# Altium schematic sheet leds.SchDoc
size A4; SheetNumber: 11; SheetTotal: 11
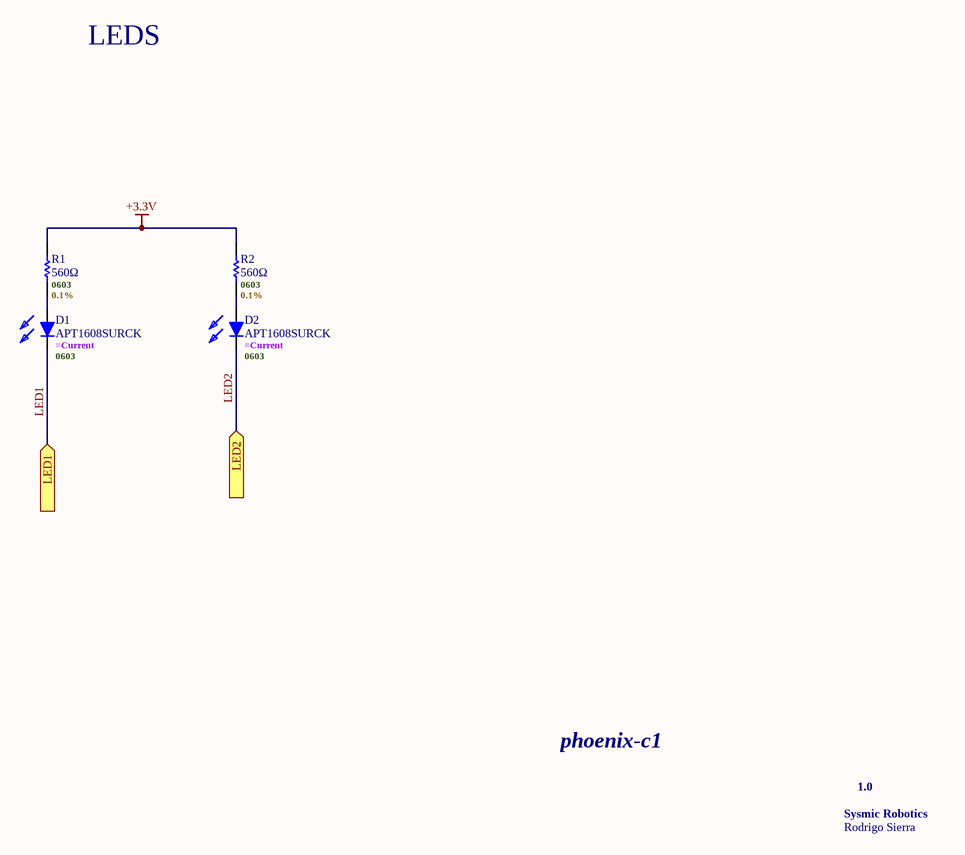
[diagram p0: leds.SchDoc]

## Parts
D1  APT1608SURCK  .Case/Package: 0603  [LED0603 - KINGBRIGHT]
D2  APT1608SURCK  .Case/Package: 0603  [LED0603 - KINGBRIGHT]
R1  560Ω  .Case/Package: 0603  .Tolerance: 0.1%  [R0603 - YAGEO]
R2  560Ω  .Case/Package: 0603  .Tolerance: 0.1%  [R0603 - YAGEO]

## Ports
LED1 (in, see phoenix-c1-sch[2C], stm32g4[3C]), LED2 (in, see phoenix-c1-sch[2C], stm32g4[3C])

## Nets
+3.3V: R1.2 R2.2
LED1: D1.1 ; port LED1
LED2: D2.1 ; port LED2
NetD1_2: D1.2 R1.1
NetD2_2: D2.2 R2.1

## Notes on the sheet
- LEDS
- phoenix-c1
- Sysmic Robotics
- 1.0
- Rodrigo Sierra

## Library data of the parts
D1 D2 = APT1608SURCK: APT1608SURCK Red Led, 630 Nm 1608 (0603) Clear, Rectangle Lens SMD Package; Manufacturer: Kingbright; Dominant Wavelength: 630nm; Forward Current: 30mA; Forward Voltage: 1.95V; Lens Style: Clear, Flat; Luminous Intensity: 150mcd; Max Junction Temperature (Tj): 115°C; Number of Circuits: 1; Peak Wavelength: 650nm; Power Dissipation: 75mW; Reverse Voltage: 5V; Shape: Rectangular; Test Current: 20mA; Viewing Angle: 120°; Supplier: Mouser; Supplier Part Number: 604-APT1608SURCK; Manufacturer Part Number: APT1608SURCK; RoHS: Compliant; Category: LEDs; Stock: 38283; Pricing: 1=0,2, 10=0,136, 50=0,136, 100=0,091, 1000=0,067, 10000=0,049 (USD); Case/Package: 0603; Case Code (Imperial): 0603; Case Code (Metric): 1608; Color: Red; Contact Plating: Gold; Height: 750µm; Illumination Color: Red; Lead Free: Lead Free; Length: 1.6mm; Lens Color: Clear; Lifecycle Status: Production; Max Operating Temperature: 85°C; Min Operating Temperature: -40°C; Mounting Technology: Surface Mount; Number of LEDs: 1; Pins: 2; Number of Terminals: 2; Packaging: Tape & Reel (TR); REACH SVHC: Yes; Schedule B: 8541402000, 8541402000|8541402000, 8541402000|8541402000|8541402000, 8541402000|8541402000|8541402000|8541402000; Terminal Pitch: 1.65mm; Wavelength: 630nm; Width: 800µm; ComponentLink1URL: https://datasheet.octopart.com:443/APT1608SURCK-Kingbright-datasheet-180517304.pdf?src-supplier=IHS; ComponentLink1Description: https://datasheet.octopart.com:443/APT1608SURCK-Kingbright-datasheet-180517304.pdf?src-supplier=IHS; ComponentLink2URL: https://datasheet.octopart.com:443/APT1608SURCK-Kingbright-datasheet-158492.pdf?src-supplier=IHS; ComponentLink2Description: https://datasheet.octopart.com:443/APT1608SURCK-Kingbright-datasheet-158492.pdf?src-supplier=IHS; ComponentLink3URL: https://datasheet.octopart.com:443/APT1608SURCK-Kingbright-datasheet-134530437.pdf?src-supplier=Upverter; ComponentLink3Description: https://datasheet.octopart.com:443/APT1608SURCK-Kingbright-datasheet-134530437.pdf?src-supplier=Upverter; ComponentLink4URL: https://datasheet.octopart.com:443/APT1608SURCK-Kingbright-datasheet-8331631.pdf?src-supplier=Sager+Electronics; ComponentLink4Description: https://datasheet.octopart.com:443/APT1608SURCK-Kingbright-datasheet-8331631.pdf?src-supplier=Sager+Electronics; ComponentLink5URL: https://datasheet.octopart.com:443/APT1608SURCK-Kingbright-datasheet-9964258.pdf?src-supplier=RS+(Formerly+Allied+Electronics); ComponentLink5Description: https://datasheet.octopart.com:443/APT1608SURCK-Kingbright-datasheet-9964258.pdf?src-supplier=RS+(Formerly+Allied+Electronics); Supplier 1: Mouser; Supplier Part Number 1: 604-APT1608SURCK; .Current: =Current
R1 R2 = RT0603BRD07560RL: Res Thin Film 0603 560 Ohm 0.1% 0.1W(1/10W) ±25ppm/C Pad SMD T/R; Manufacturer: Yageo Group; Max Power Dissipation: 100mW; Temperature Coefficient: 25ppm/°C; Voltage Rating: 75V; Voltage Rating (DC): 50V; Supplier: Mouser; Supplier Part Number: 603-RT0603BRD07560RL; Manufacturer Part Number: RT0603BRD07560RL; RoHS: Compliant; Category: Chip SMD Resistors; Stock: 19960; Pricing: 1=0,1, 10=0,053, 50=0,053, 100=0,046, 1000=0,042, 10000=0,039 (USD); Case/Package: 0603; Case Code (Imperial): 0603; China RoHS: Non-Compliant; Composition: Thin Film; Contact Plating: Tin; Depth: 800µm; Features: Moisture Resistant; Height: 450µm; Lead Free: Lead Free; Length: 1.6mm; Lifecycle Status: Production; Max Operating Temperature: 155°C; Military Standard: Not; Min Operating Temperature: -55°C; Mounting Technology: Surface Mount; Number of Terminals: 2; Number of Terminations: 2; Power Dissipation: 100mW; Power Rating: 100mW; Radiation Hardening: No; REACH SVHC: Yes; Value: 560Ω; Schedule B: 8533210045, 8533210045|8533210045, 8533210045|8533210045|8533210045, 8533210045|8533210045|8533210045|8533210045; Termination: SMD/SMT; Tolerance: 0.1%; Weight: 2.012816mg; Width: 800µm; Working Voltage: 75V; ComponentLink1URL: https://datasheet.octopart.com:443/RT0603BRD07560RL-Yageo-datasheet-176402239.pdf?src-supplier=Newark; ComponentLink1Description: https://datasheet.octopart.com:443/RT0603BRD07560RL-Yageo-datasheet-176402239.pdf?src-supplier=Newark; ComponentLink2URL: https://datasheet.octopart.com:443/RT0603BRD07560RL-Yageo-datasheet-96443642.pdf?src-supplier=Upverter; ComponentLink2Description: https://datasheet.octopart.com:443/RT0603BRD07560RL-Yageo-datasheet-96443642.pdf?src-supplier=Upverter; ComponentLink3URL: https://datasheet.octopart.com:443/RT0603BRD07560RL-Yageo-datasheet-169971040.pdf?src-supplier=Future+Electronics; ComponentLink3Description: https://datasheet.octopart.com:443/RT0603BRD07560RL-Yageo-datasheet-169971040.pdf?src-supplier=Future+Electronics; ComponentLink4URL: https://datasheet.octopart.com:443/RT0603BRD07560RL-Yageo-datasheet-166250672.pdf?src-supplier=Future+Electronics; ComponentLink4Description: https://datasheet.octopart.com:443/RT0603BRD07560RL-Yageo-datasheet-166250672.pdf?src-supplier=Future+Electronics; ComponentLink5URL: https://datasheet.octopart.com:443/RT0603BRD07560RL-Yageo-datasheet-137700930.pdf?src-supplier=Future+Electronics; ComponentLink5Description: https://datasheet.octopart.com:443/RT0603BRD07560RL-Yageo-datasheet-137700930.pdf?src-supplier=Future+Electronics; ComponentLink6URL: https://datasheet.octopart.com:443/RT0603BRD07560RL-Yageo-Group-datasheet-141265893.pdf?src-supplier=ODG+(Origin+Data+Global); ComponentLink6Description: https://datasheet.octopart.com:443/RT0603BRD07560RL-Yageo-Group-datasheet-141265893.pdf?src-supplier=ODG+(Origin+Data+Global); ComponentLink7URL: https://datasheet.octopart.com:443/RT0603BRD07560RL-Yageo-datasheet-10915759.pdf?src-supplier=_legacy+Avnet; ComponentLink7Description: https://datasheet.octopart.com:443/RT0603BRD07560RL-Yageo-datasheet-10915759.pdf?src-supplier=_legacy+Avnet; ComponentLink8URL: https://datasheet.octopart.com/RT0603BRD07560RL-Yageo-datasheet-86813807.pdf; ComponentLink8Description: https://datasheet.octopart.com/RT0603BRD07560RL-Yageo-datasheet-86813807.pdf; ComponentLink9URL: http://sigma.octopart.com:80/rohs_statement/Yageo-company-2.pdf?src-supplier=Compliance+Statements; ComponentLink9Description: http://sigma.octopart.com:80/rohs_statement/Yageo-company-2.pdf?src-supplier=Compliance+Statements; ComponentLink10URL: http://sigma.octopart.com:80/conflict_mineral_statement/Yageo-company-3.pdf?src-supplier=Compliance+Statements; ComponentLink10Description: http://sigma.octopart.com:80/conflict_mineral_statement/Yageo-company-3.pdf?src-supplier=Compliance+Statements; Supplier 1: Mouser; Supplier Part Number 1: 603-RT0603BRD07560RL